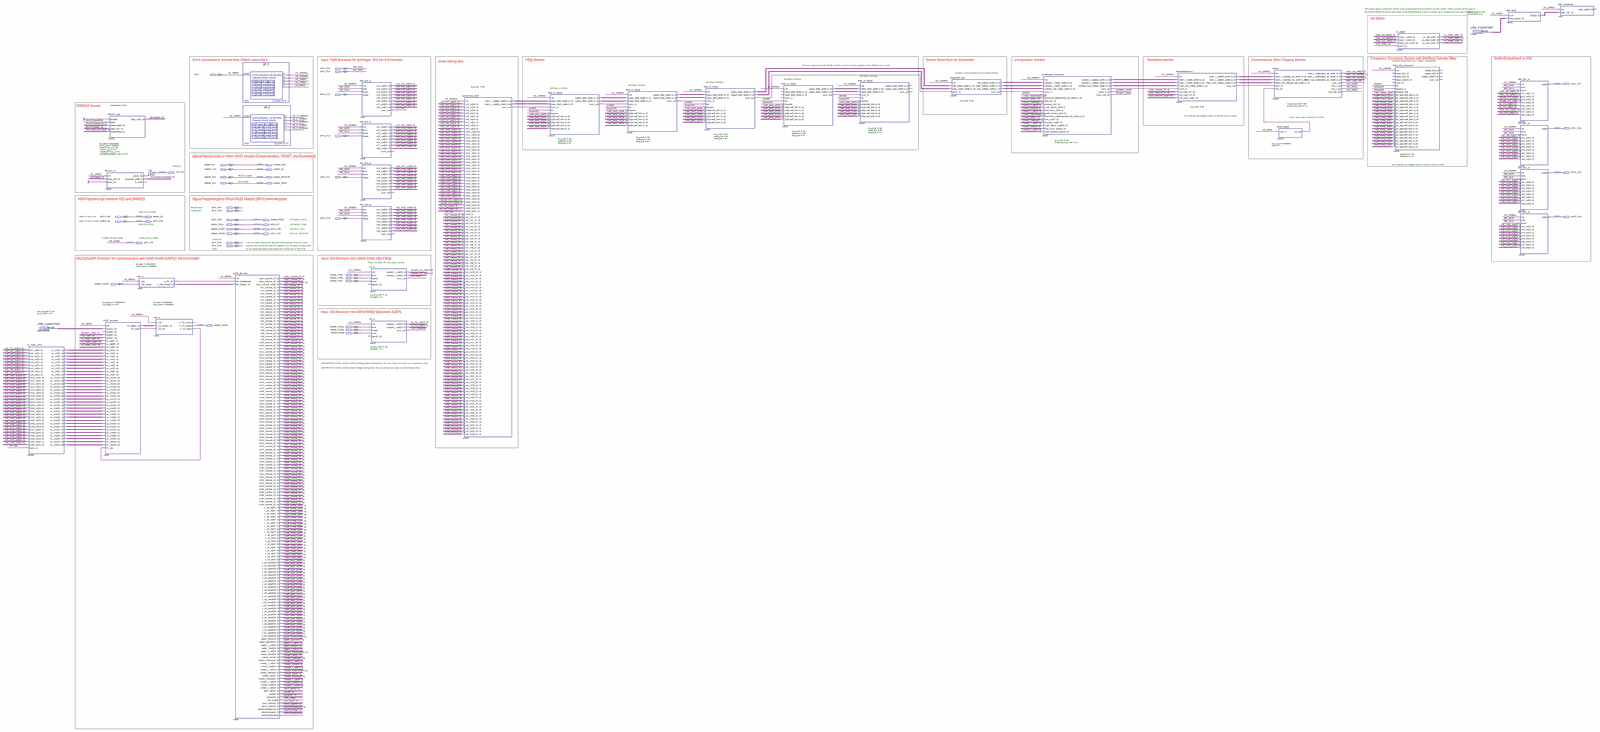
[diagram p0: schematic sheet, whole]
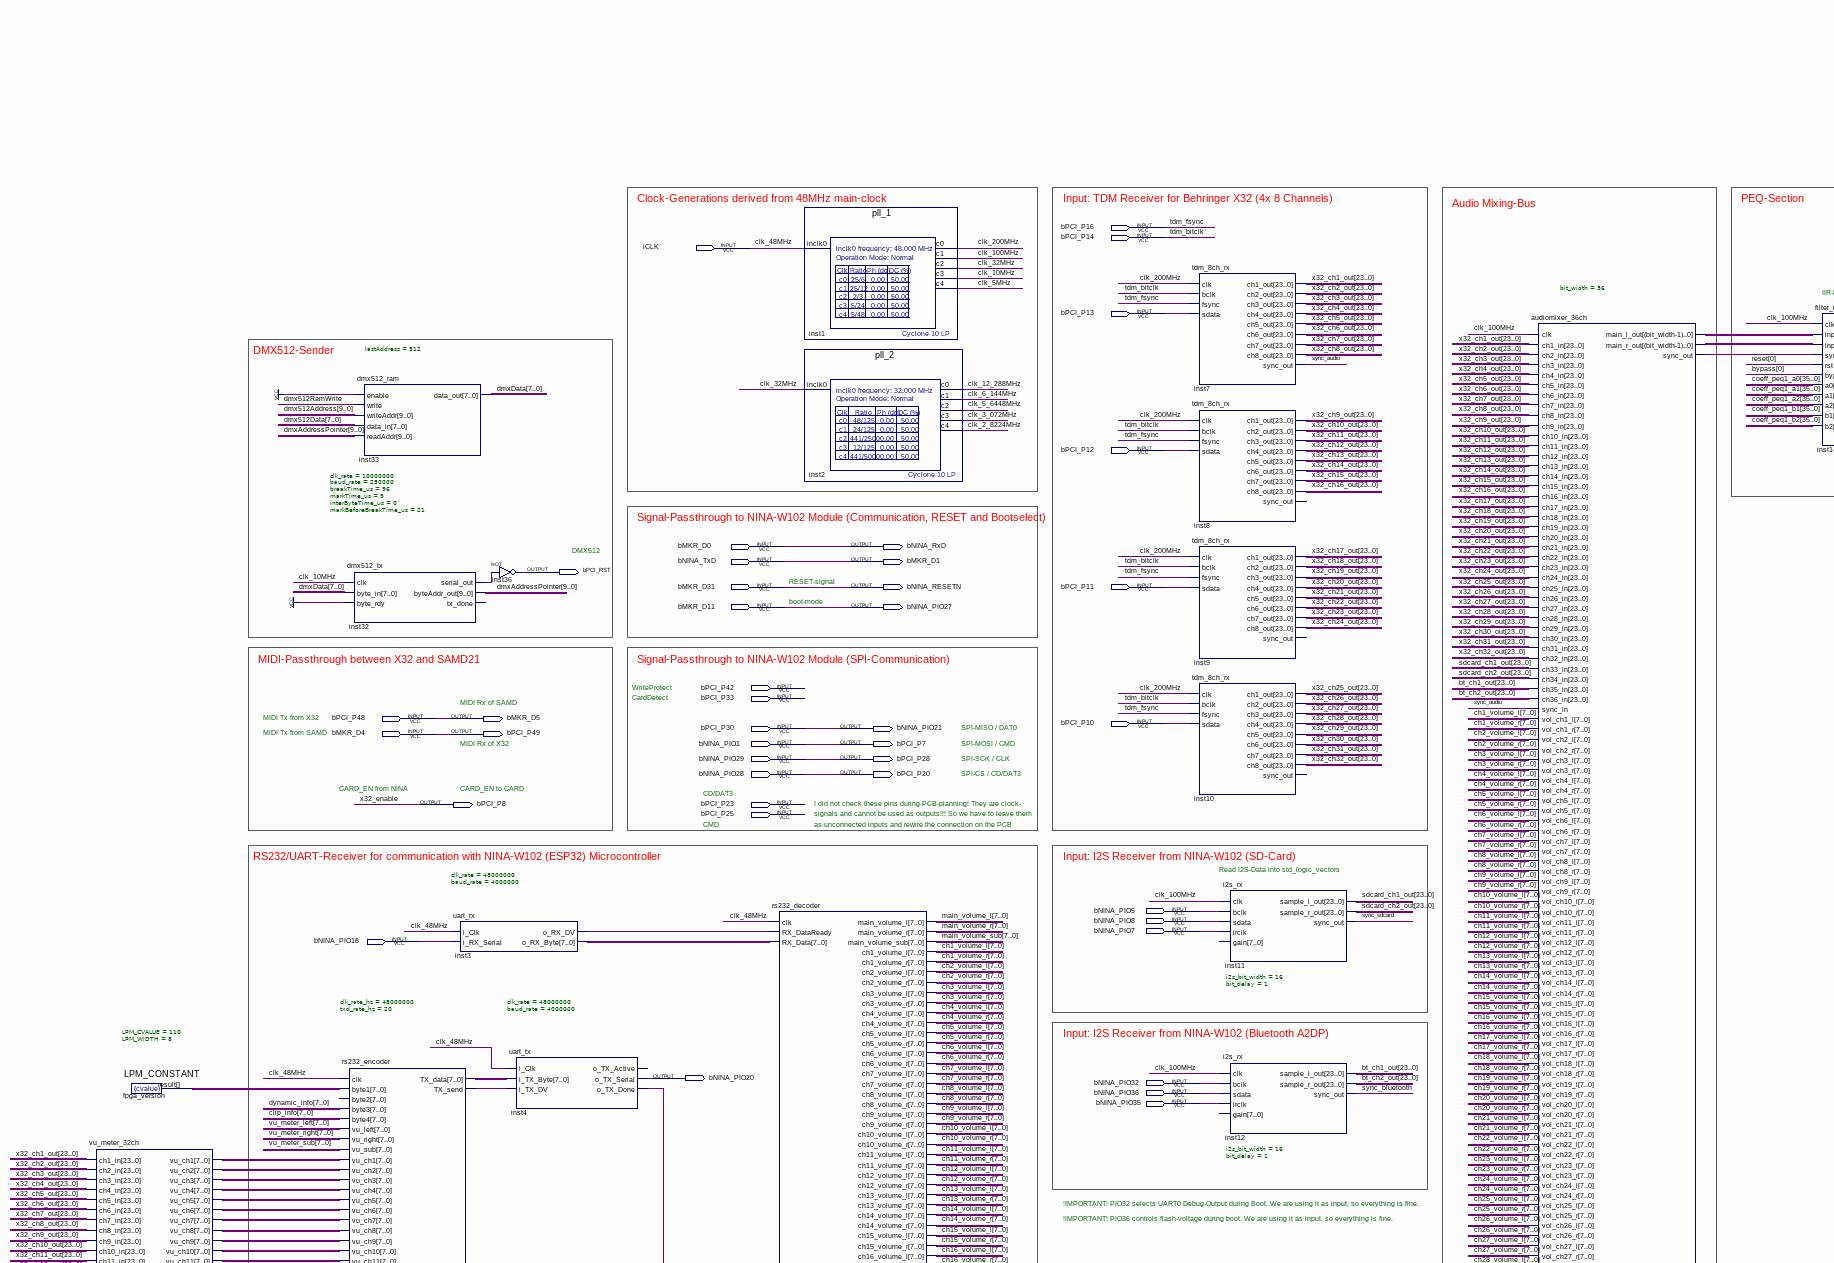
[diagram p1: schematic sheet, upper left part]
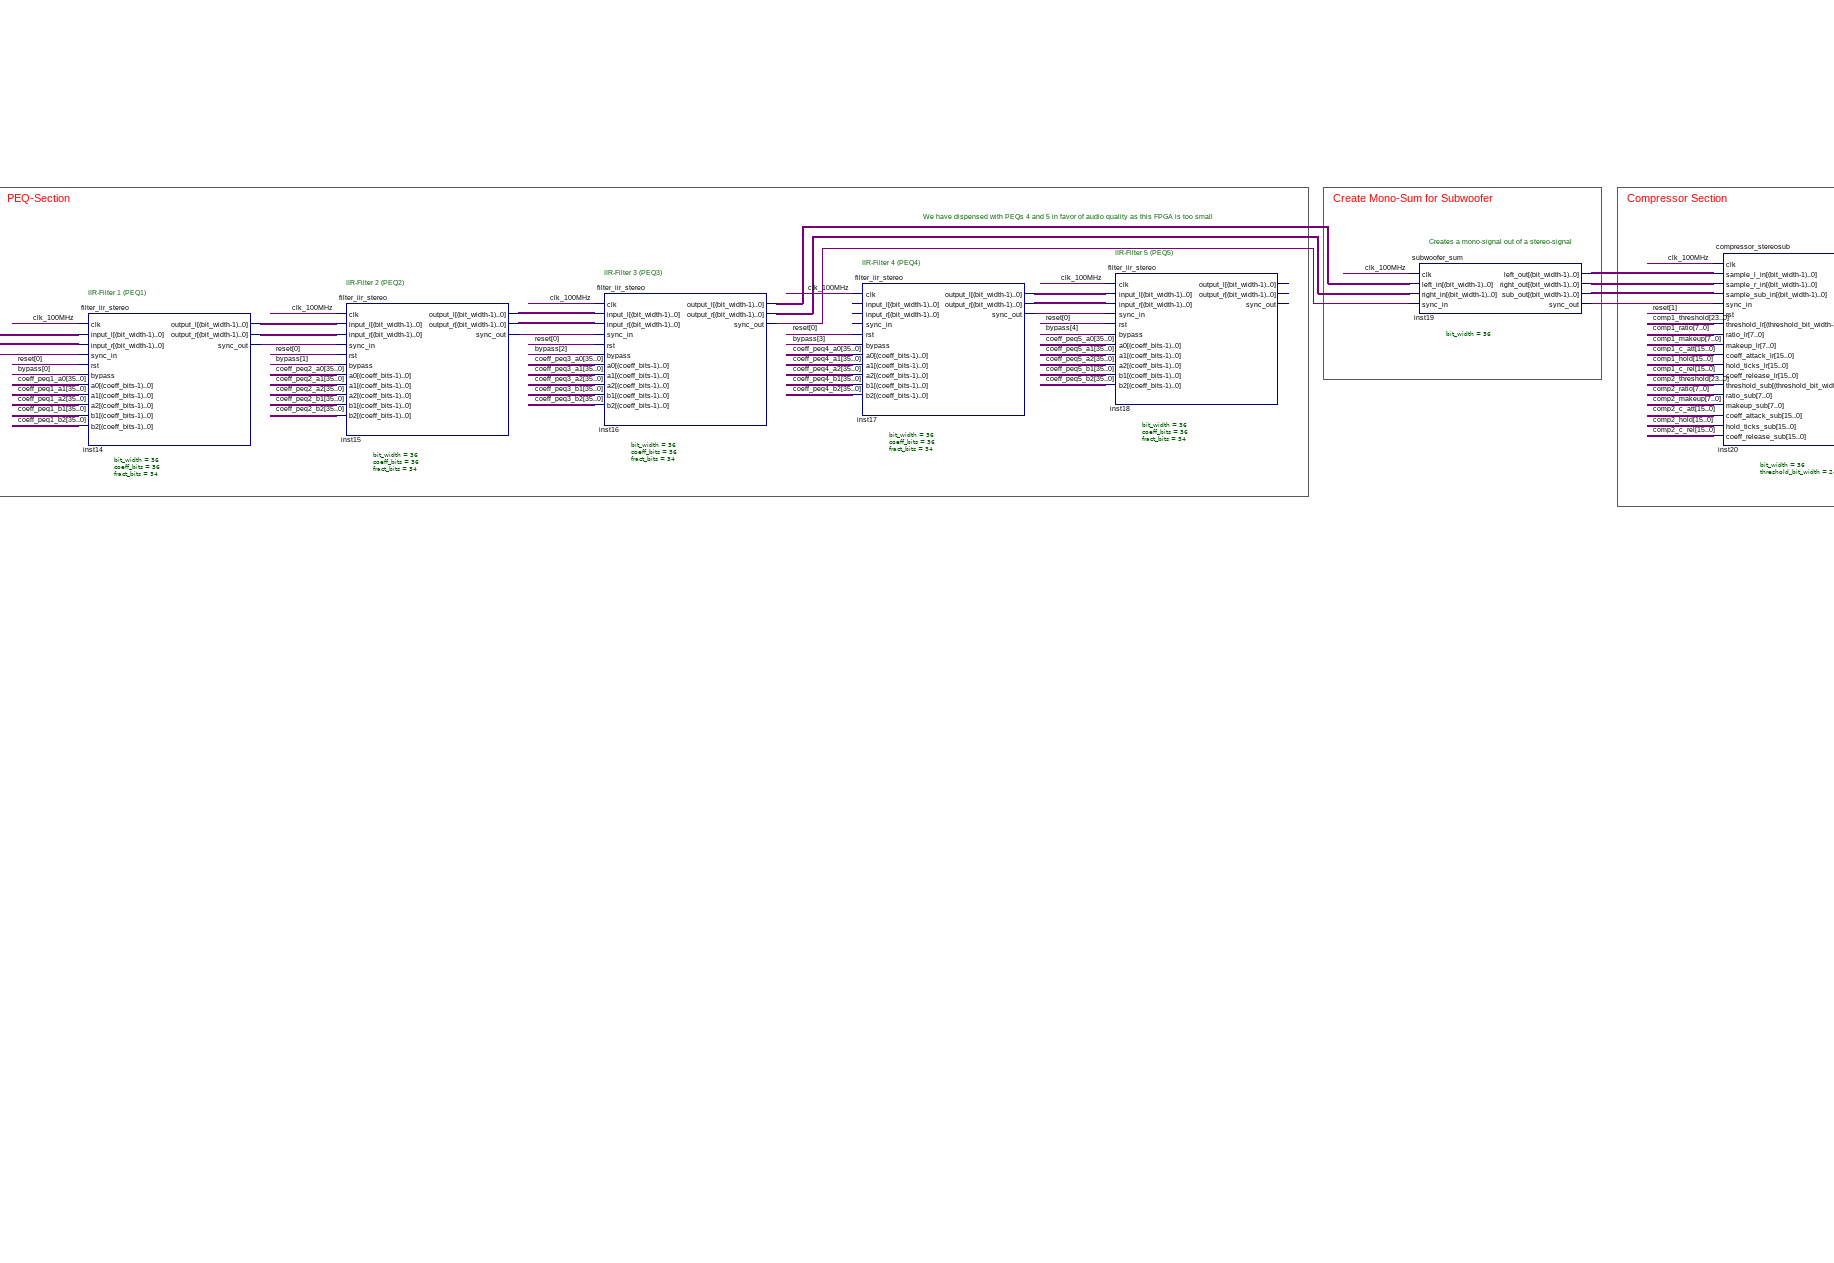
[diagram p2: schematic sheet, upper centre part]
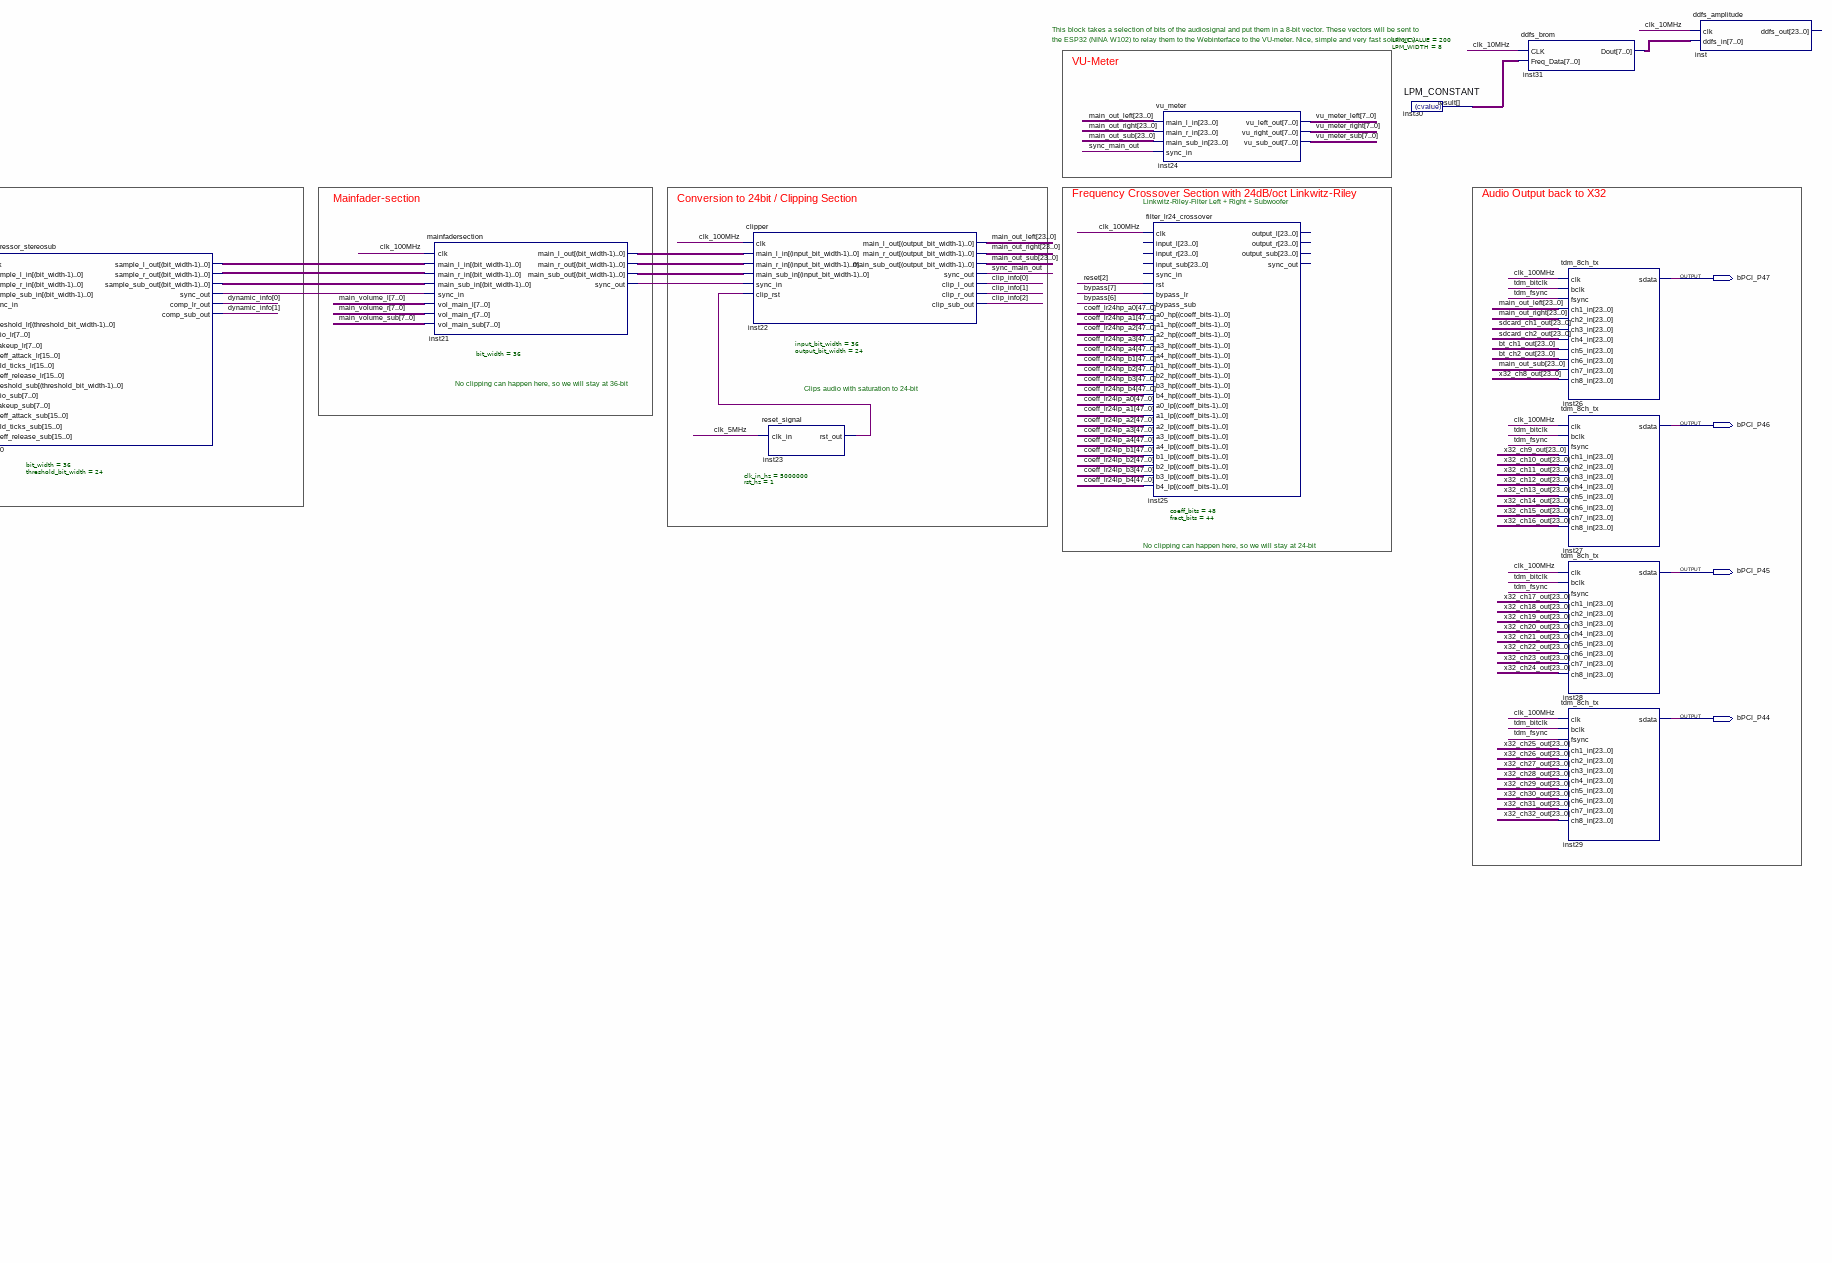
[diagram p3: schematic sheet, upper right part]
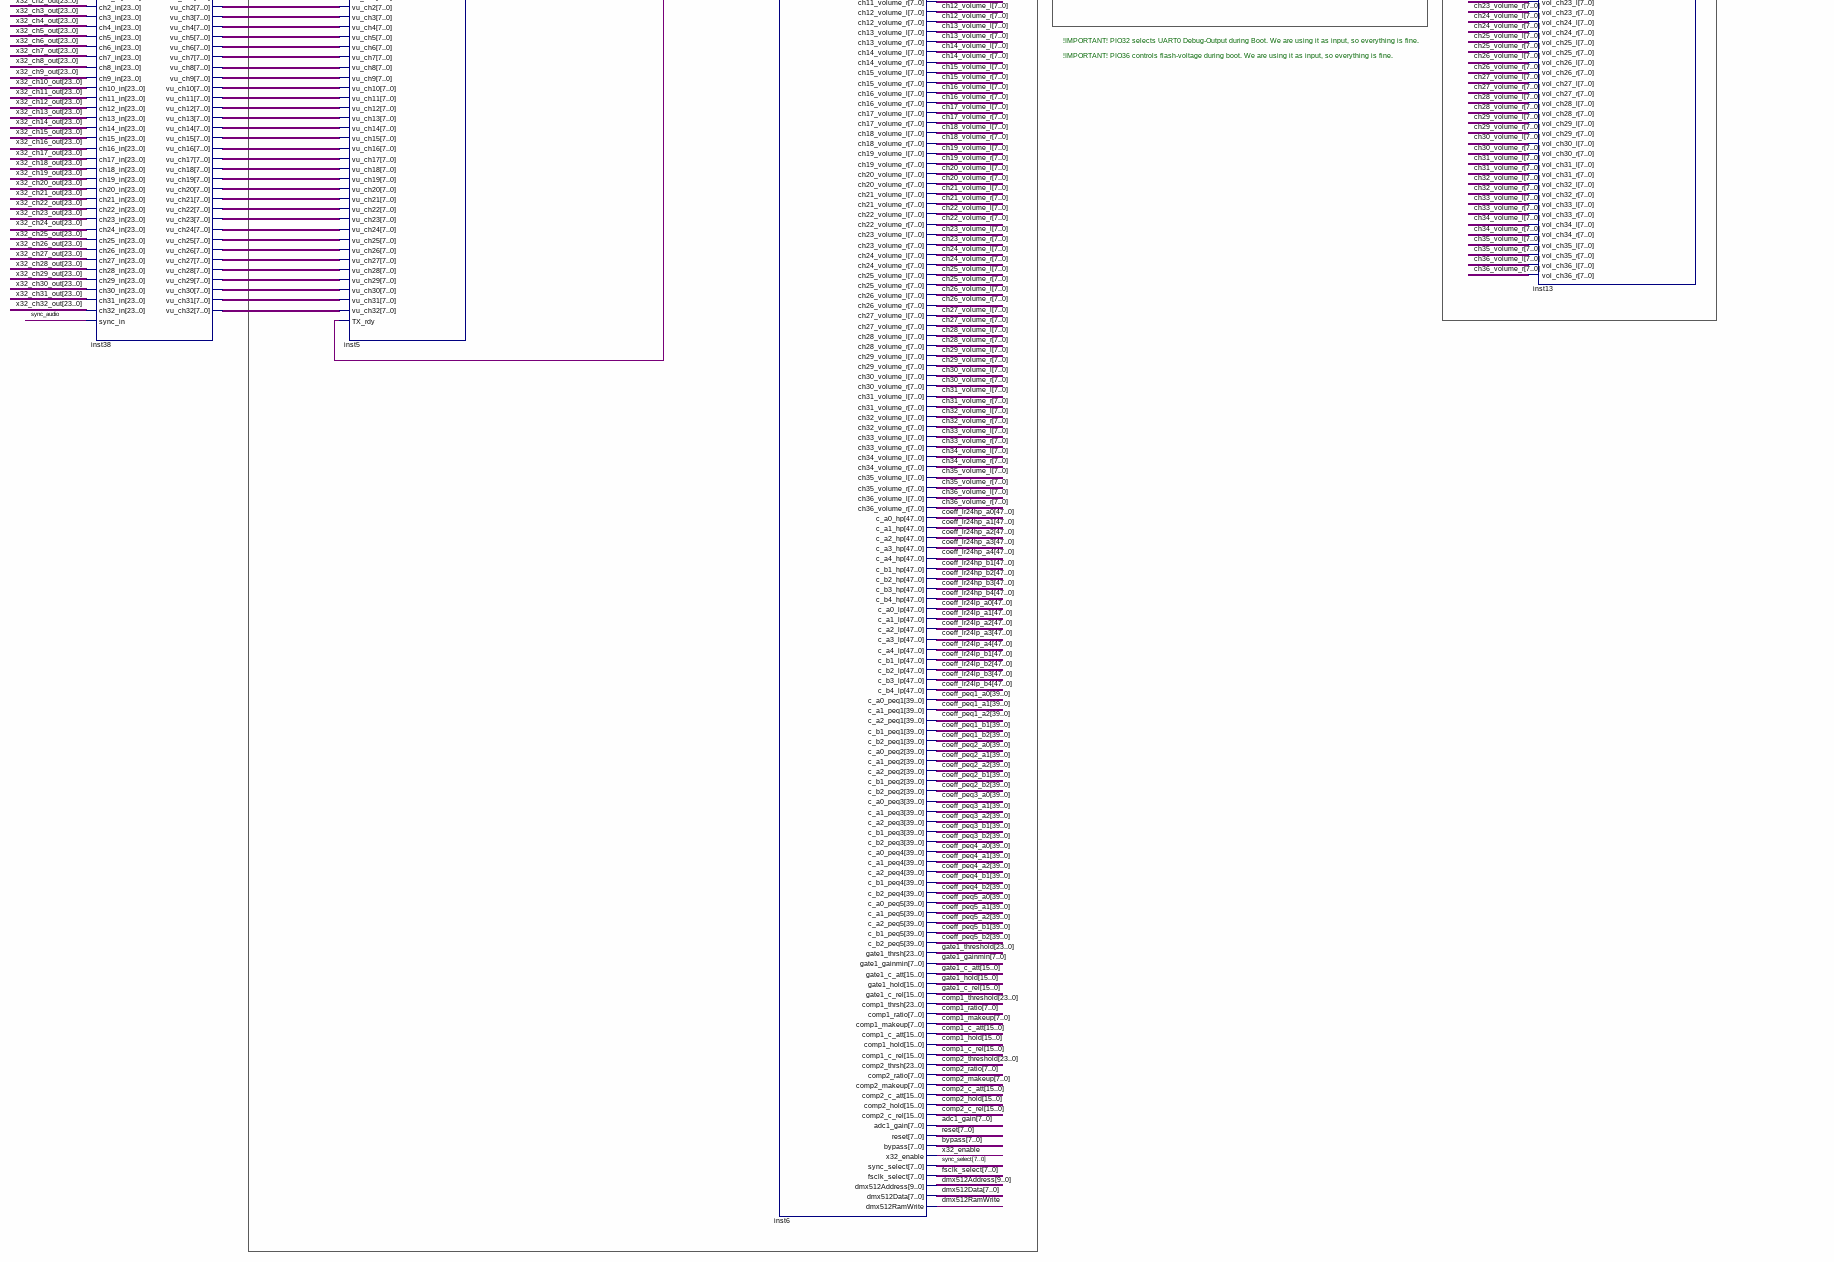
[diagram p4: schematic sheet, lower left part]
// Quartus schematic Audioplayer.bdf as structural Verilog: 37 symbols, 45 pins
module Audioplayer (
  input  bPCI_P16,
  input  bPCI_P14,
  input  iCLK,
  input  bPCI_P13,
  input  bPCI_P12,
  input  bMKR_D0,
  input  bNINA_TxD,
  input  bMKR_D31,
  input  bPCI_P11,
  input  bMKR_D11,
  input  bPCI_P42,
  input  bPCI_P33,
  input  bPCI_P48,
  input  bPCI_P10,
  input  bPCI_P30,
  input  bMKR_D4,
  input  bNINA_PIO1,
  input  bNINA_PIO29,
  input  bNINA_PIO28,
  input  bPCI_P23,
  input  bPCI_P25,
  input  bNINA_PIO5,
  input  bNINA_PIO8,
  input  bNINA_PIO7,
  input  bNINA_PIO18,
  input  bNINA_PIO32,
  input  bNINA_PIO36,
  input  bNINA_PIO35,
  output bPCI_P47,
  output bPCI_P46,
  output bNINA_RxD,
  output bMKR_D1,
  output bPCI_RST,
  output bPCI_P45,
  output bNINA_RESETN,
  output bNINA_PIO27,
  output bMKR_D5,
  output bPCI_P44,
  output bNINA_PIO21,
  output bPCI_P49,
  output bPCI_P7,
  output bPCI_P28,
  output bPCI_P20,
  output bPCI_P8,
  output bNINA_PIO20
);

  wire clk_2_8224MHz, clk_3_072MHz, clk_5_6448MHz, clk_5MHz, clk_6_144MHz, clk_10MHz, clk_12_288MHz,
       clk_32MHz, clk_100MHz, clk_200MHz, dmx512RamWrite, inst3_o_rx_dv, inst4_o_tx_done, inst5_tx_send,
       inst13_sync_out, inst14_sync_out, inst15_sync_out, inst16_sync_out, inst17_sync_out, inst19_sync_out,
       inst20_sync_out, inst21_sync_out, inst23_rst_out, inst32_serial_out, sync_audio, sync_bluetooth,
       sync_main_out, sync_sdcard;
  wire [7:0] adc1_gain, bypass, ch1_volume_l, ch1_volume_r, ch2_volume_l, ch2_volume_r, ch3_volume_l,
       ch3_volume_r, ch4_volume_l, ch4_volume_r, ch5_volume_l, ch5_volume_r, ch6_volume_l, ch6_volume_r,
       ch7_volume_l, ch7_volume_r, ch8_volume_l, ch8_volume_r, ch9_volume_l, ch9_volume_r, ch10_volume_l,
       ch10_volume_r, ch11_volume_l, ch11_volume_r, ch12_volume_l, ch12_volume_r, ch13_volume_l,
       ch13_volume_r, ch14_volume_l, ch14_volume_r, ch15_volume_l, ch15_volume_r, ch16_volume_l,
       ch16_volume_r, ch17_volume_l, ch17_volume_r, ch18_volume_l, ch18_volume_r, ch19_volume_l,
       ch19_volume_r, ch20_volume_l, ch20_volume_r, ch21_volume_l, ch21_volume_r, ch22_volume_l,
       ch22_volume_r, ch23_volume_l, ch23_volume_r, ch24_volume_l, ch24_volume_r, ch25_volume_l,
       ch25_volume_r, ch26_volume_l, ch26_volume_r, ch27_volume_l, ch27_volume_r, ch28_volume_l,
       ch28_volume_r, ch29_volume_l, ch29_volume_r, ch30_volume_l, ch30_volume_r, ch31_volume_l,
       ch31_volume_r, ch32_volume_l, ch32_volume_r, ch33_volume_l, ch33_volume_r, ch34_volume_l,
       ch34_volume_r, ch35_volume_l, ch35_volume_r, ch36_volume_l, ch36_volume_r, clip_info, comp1_makeup,
       comp1_ratio, comp2_makeup, comp2_ratio, dmx512Data, dmxData, dynamic_info, fpga_version_result,
       fsclk_select, gate1_gainmin, inst3_o_rx_byte, inst5_tx_data, inst30_result, inst31_dout,
       inst38_vu_ch1, inst38_vu_ch2, inst38_vu_ch3, inst38_vu_ch4, inst38_vu_ch5, inst38_vu_ch6,
       inst38_vu_ch7, inst38_vu_ch8, inst38_vu_ch9, inst38_vu_ch10, inst38_vu_ch11, inst38_vu_ch12,
       inst38_vu_ch13, inst38_vu_ch14, inst38_vu_ch15, inst38_vu_ch16, inst38_vu_ch17, inst38_vu_ch18,
       inst38_vu_ch19, inst38_vu_ch20, inst38_vu_ch21, inst38_vu_ch22, inst38_vu_ch23, inst38_vu_ch24,
       inst38_vu_ch25, inst38_vu_ch26, inst38_vu_ch27, inst38_vu_ch28, inst38_vu_ch29, inst38_vu_ch30,
       inst38_vu_ch31, inst38_vu_ch32, main_volume_l, main_volume_r, main_volume_sub, reset, sync_select,
       vu_meter_left, vu_meter_right, vu_meter_sub;
  wire [9:0] dmx512Address, dmxAddressPointer;
  wire [15:0] comp1_c_att, comp1_c_rel, comp1_hold, comp2_c_att, comp2_c_rel, comp2_hold, gate1_c_att,
       gate1_c_rel, gate1_hold;
  wire [23:0] bt_ch1_out, bt_ch2_out, comp1_threshold, comp2_threshold, gate1_threshold, main_out_left,
       main_out_right, main_out_sub, sdcard_ch1_out, sdcard_ch2_out, x32_ch1_out, x32_ch2_out, x32_ch3_out,
       x32_ch4_out, x32_ch5_out, x32_ch6_out, x32_ch7_out, x32_ch8_out, x32_ch9_out, x32_ch10_out,
       x32_ch11_out, x32_ch12_out, x32_ch13_out, x32_ch14_out, x32_ch15_out, x32_ch16_out, x32_ch17_out,
       x32_ch18_out, x32_ch19_out, x32_ch20_out, x32_ch21_out, x32_ch22_out, x32_ch23_out, x32_ch24_out,
       x32_ch25_out, x32_ch26_out, x32_ch27_out, x32_ch28_out, x32_ch29_out, x32_ch30_out, x32_ch31_out,
       x32_ch32_out;
  wire [35:0] inst13_main_l_out, inst13_main_r_out, inst14_output_l, inst14_output_r, inst15_output_l,
       inst15_output_r, inst16_output_l, inst16_output_r, inst17_output_l, inst17_output_r, inst19_left_out,
       inst19_right_out, inst19_sub_out, inst20_sample_l_out, inst20_sample_r_out, inst20_sample_sub_out,
       inst21_main_l_out, inst21_main_r_out, inst21_main_sub_out;
  wire [39:0] coeff_peq1_a0, coeff_peq1_a1, coeff_peq1_a2, coeff_peq1_b1, coeff_peq1_b2, coeff_peq2_a0,
       coeff_peq2_a1, coeff_peq2_a2, coeff_peq2_b1, coeff_peq2_b2, coeff_peq3_a0, coeff_peq3_a1,
       coeff_peq3_a2, coeff_peq3_b1, coeff_peq3_b2, coeff_peq4_a0, coeff_peq4_a1, coeff_peq4_a2,
       coeff_peq4_b1, coeff_peq4_b2, coeff_peq5_a0, coeff_peq5_a1, coeff_peq5_a2, coeff_peq5_b1,
       coeff_peq5_b2;
  wire [47:0] coeff_lr24hp_a0, coeff_lr24hp_a1, coeff_lr24hp_a2, coeff_lr24hp_a3, coeff_lr24hp_a4,
       coeff_lr24hp_b1, coeff_lr24hp_b2, coeff_lr24hp_b3, coeff_lr24hp_b4, coeff_lr24lp_a0, coeff_lr24lp_a1,
       coeff_lr24lp_a2, coeff_lr24lp_a3, coeff_lr24lp_a4, coeff_lr24lp_b1, coeff_lr24lp_b2, coeff_lr24lp_b3,
       coeff_lr24lp_b4;

  vu_meter_32ch inst38 (
    .ch1_in(x32_ch1_out), .ch2_in(x32_ch2_out), .ch3_in(x32_ch3_out), .ch4_in(x32_ch4_out),
    .ch5_in(x32_ch5_out), .ch6_in(x32_ch6_out), .ch7_in(x32_ch7_out), .ch8_in(x32_ch8_out),
    .ch9_in(x32_ch9_out), .ch10_in(x32_ch10_out), .ch11_in(x32_ch11_out), .ch12_in(x32_ch12_out),
    .ch13_in(x32_ch13_out), .ch14_in(x32_ch14_out), .ch15_in(x32_ch15_out), .ch16_in(x32_ch16_out),
    .ch17_in(x32_ch17_out), .ch18_in(x32_ch18_out), .ch19_in(x32_ch19_out), .ch20_in(x32_ch20_out),
    .ch21_in(x32_ch21_out), .ch22_in(x32_ch22_out), .ch23_in(x32_ch23_out), .ch24_in(x32_ch24_out),
    .ch25_in(x32_ch25_out), .ch26_in(x32_ch26_out), .ch27_in(x32_ch27_out), .ch28_in(x32_ch28_out),
    .ch29_in(x32_ch29_out), .ch30_in(x32_ch30_out), .ch31_in(x32_ch31_out), .ch32_in(x32_ch32_out),
    .sync_in(sync_audio), .vu_ch1(inst38_vu_ch1), .vu_ch2(inst38_vu_ch2), .vu_ch3(inst38_vu_ch3),
    .vu_ch4(inst38_vu_ch4), .vu_ch5(inst38_vu_ch5), .vu_ch6(inst38_vu_ch6), .vu_ch7(inst38_vu_ch7),
    .vu_ch8(inst38_vu_ch8), .vu_ch9(inst38_vu_ch9), .vu_ch10(inst38_vu_ch10), .vu_ch11(inst38_vu_ch11),
    .vu_ch12(inst38_vu_ch12), .vu_ch13(inst38_vu_ch13), .vu_ch14(inst38_vu_ch14), .vu_ch15(inst38_vu_ch15),
    .vu_ch16(inst38_vu_ch16), .vu_ch17(inst38_vu_ch17), .vu_ch18(inst38_vu_ch18), .vu_ch19(inst38_vu_ch19),
    .vu_ch20(inst38_vu_ch20), .vu_ch21(inst38_vu_ch21), .vu_ch22(inst38_vu_ch22), .vu_ch23(inst38_vu_ch23),
    .vu_ch24(inst38_vu_ch24), .vu_ch25(inst38_vu_ch25), .vu_ch26(inst38_vu_ch26), .vu_ch27(inst38_vu_ch27),
    .vu_ch28(inst38_vu_ch28), .vu_ch29(inst38_vu_ch29), .vu_ch30(inst38_vu_ch30), .vu_ch31(inst38_vu_ch31),
    .vu_ch32(inst38_vu_ch32));
  LPM_CONSTANT #(.LPM_CVALUE(110), .LPM_WIDTH(8)) fpga_version (.result(fpga_version_result));
  dmx512_ram #(.lastAddress(512)) inst33 (
    .enable(1'b1), .write(dmx512RamWrite), .writeAddr(dmx512Address), .data_in(dmx512Data),
    .readAddr(dmxAddressPointer), .data_out(dmxData));
  dmx512_tx #(.clk_rate(10000000), .baud_rate(250000), .breakTime_us(96), .markTime_us(9), .interByteTime_us(0), .markBeforeBreakTime_us(21)) inst32 (
    .clk(clk_10MHz), .byte_in(dmxData), .byte_rdy(1'b1), .serial_out(inst32_serial_out),
    .byteAddr_out(dmxAddressPointer));  // open: tx_done
  rs232_encoder #(.clk_rate_hz(48000000), .txd_rate_hz(20)) inst5 (
    .clk(iCLK), .byte1(fpga_version_result), .byte3(dynamic_info), .byte4(clip_info),
    .vu_left(vu_meter_left), .vu_right(vu_meter_right), .vu_sub(vu_meter_sub), .vu_ch1(inst38_vu_ch1),
    .vu_ch2(inst38_vu_ch2), .vu_ch3(inst38_vu_ch3), .vu_ch4(inst38_vu_ch4), .vu_ch5(inst38_vu_ch5),
    .vu_ch6(inst38_vu_ch6), .vu_ch7(inst38_vu_ch7), .vu_ch8(inst38_vu_ch8), .vu_ch9(inst38_vu_ch9),
    .vu_ch10(inst38_vu_ch10), .vu_ch11(inst38_vu_ch11), .vu_ch12(inst38_vu_ch12), .vu_ch13(inst38_vu_ch13),
    .vu_ch14(inst38_vu_ch14), .vu_ch15(inst38_vu_ch15), .vu_ch16(inst38_vu_ch16), .vu_ch17(inst38_vu_ch17),
    .vu_ch18(inst38_vu_ch18), .vu_ch19(inst38_vu_ch19), .vu_ch20(inst38_vu_ch20), .vu_ch21(inst38_vu_ch21),
    .vu_ch22(inst38_vu_ch22), .vu_ch23(inst38_vu_ch23), .vu_ch24(inst38_vu_ch24), .vu_ch25(inst38_vu_ch25),
    .vu_ch26(inst38_vu_ch26), .vu_ch27(inst38_vu_ch27), .vu_ch28(inst38_vu_ch28), .vu_ch29(inst38_vu_ch29),
    .vu_ch30(inst38_vu_ch30), .vu_ch31(inst38_vu_ch31), .vu_ch32(inst38_vu_ch32), .TX_rdy(inst4_o_tx_done),
    .TX_data(inst5_tx_data), .TX_send(inst5_tx_send));  // open: byte2
  uart_rx #(.clk_rate(48000000), .baud_rate(4000000)) inst3 (
    .i_Clk(iCLK), .i_RX_Serial(bNINA_PIO18), .o_RX_DV(inst3_o_rx_dv), .o_RX_Byte(inst3_o_rx_byte));
  not inst36 (bPCI_RST, inst32_serial_out);
  uart_tx #(.clk_rate(48000000), .baud_rate(4000000)) inst4 (
    .i_Clk(iCLK), .i_TX_Byte(inst5_tx_data), .i_TX_DV(inst5_tx_send), .o_TX_Serial(bNINA_PIO20),
    .o_TX_Done(inst4_o_tx_done));  // open: o_TX_Active
  rs232_decoder inst6 (
    .clk(iCLK), .RX_DataReady(inst3_o_rx_dv), .RX_Data(inst3_o_rx_byte), .main_volume_l(main_volume_l),
    .main_volume_r(main_volume_r), .main_volume_sub(main_volume_sub), .ch1_volume_l(ch1_volume_l),
    .ch1_volume_r(ch1_volume_r), .ch2_volume_l(ch2_volume_l), .ch2_volume_r(ch2_volume_r),
    .ch3_volume_l(ch3_volume_l), .ch3_volume_r(ch3_volume_r), .ch4_volume_l(ch4_volume_l),
    .ch4_volume_r(ch4_volume_r), .ch5_volume_l(ch5_volume_l), .ch5_volume_r(ch5_volume_r),
    .ch6_volume_l(ch6_volume_l), .ch6_volume_r(ch6_volume_r), .ch7_volume_l(ch7_volume_l),
    .ch7_volume_r(ch7_volume_r), .ch8_volume_l(ch8_volume_l), .ch8_volume_r(ch8_volume_r),
    .ch9_volume_l(ch9_volume_l), .ch9_volume_r(ch9_volume_r), .ch10_volume_l(ch10_volume_l),
    .ch10_volume_r(ch10_volume_r), .ch11_volume_l(ch11_volume_l), .ch11_volume_r(ch11_volume_r),
    .ch12_volume_l(ch12_volume_l), .ch12_volume_r(ch12_volume_r), .ch13_volume_l(ch13_volume_l),
    .ch13_volume_r(ch13_volume_r), .ch14_volume_l(ch14_volume_l), .ch14_volume_r(ch14_volume_r),
    .ch15_volume_l(ch15_volume_l), .ch15_volume_r(ch15_volume_r), .ch16_volume_l(ch16_volume_l),
    .ch16_volume_r(ch16_volume_r), .ch17_volume_l(ch17_volume_l), .ch17_volume_r(ch17_volume_r),
    .ch18_volume_l(ch18_volume_l), .ch18_volume_r(ch18_volume_r), .ch19_volume_l(ch19_volume_l),
    .ch19_volume_r(ch19_volume_r), .ch20_volume_l(ch20_volume_l), .ch20_volume_r(ch20_volume_r),
    .ch21_volume_l(ch21_volume_l), .ch21_volume_r(ch21_volume_r), .ch22_volume_l(ch22_volume_l),
    .ch22_volume_r(ch22_volume_r), .ch23_volume_l(ch23_volume_l), .ch23_volume_r(ch23_volume_r),
    .ch24_volume_l(ch24_volume_l), .ch24_volume_r(ch24_volume_r), .ch25_volume_l(ch25_volume_l),
    .ch25_volume_r(ch25_volume_r), .ch26_volume_l(ch26_volume_l), .ch26_volume_r(ch26_volume_r),
    .ch27_volume_l(ch27_volume_l), .ch27_volume_r(ch27_volume_r), .ch28_volume_l(ch28_volume_l),
    .ch28_volume_r(ch28_volume_r), .ch29_volume_l(ch29_volume_l), .ch29_volume_r(ch29_volume_r),
    .ch30_volume_l(ch30_volume_l), .ch30_volume_r(ch30_volume_r), .ch31_volume_l(ch31_volume_l),
    .ch31_volume_r(ch31_volume_r), .ch32_volume_l(ch32_volume_l), .ch32_volume_r(ch32_volume_r),
    .ch33_volume_l(ch33_volume_l), .ch33_volume_r(ch33_volume_r), .ch34_volume_l(ch34_volume_l),
    .ch34_volume_r(ch34_volume_r), .ch35_volume_l(ch35_volume_l), .ch35_volume_r(ch35_volume_r),
    .ch36_volume_l(ch36_volume_l), .ch36_volume_r(ch36_volume_r), .c_a0_hp(coeff_lr24hp_a0),
    .c_a1_hp(coeff_lr24hp_a1), .c_a2_hp(coeff_lr24hp_a2), .c_a3_hp(coeff_lr24hp_a3),
    .c_a4_hp(coeff_lr24hp_a4), .c_b1_hp(coeff_lr24hp_b1), .c_b2_hp(coeff_lr24hp_b2),
    .c_b3_hp(coeff_lr24hp_b3), .c_b4_hp(coeff_lr24hp_b4), .c_a0_lp(coeff_lr24lp_a0),
    .c_a1_lp(coeff_lr24lp_a1), .c_a2_lp(coeff_lr24lp_a2), .c_a3_lp(coeff_lr24lp_a3),
    .c_a4_lp(coeff_lr24lp_a4), .c_b1_lp(coeff_lr24lp_b1), .c_b2_lp(coeff_lr24lp_b2),
    .c_b3_lp(coeff_lr24lp_b3), .c_b4_lp(coeff_lr24lp_b4), .c_a0_peq1(coeff_peq1_a0),
    .c_a1_peq1(coeff_peq1_a1), .c_a2_peq1(coeff_peq1_a2), .c_b1_peq1(coeff_peq1_b1),
    .c_b2_peq1(coeff_peq1_b2), .c_a0_peq2(coeff_peq2_a0), .c_a1_peq2(coeff_peq2_a1),
    .c_a2_peq2(coeff_peq2_a2), .c_b1_peq2(coeff_peq2_b1), .c_b2_peq2(coeff_peq2_b2),
    .c_a0_peq3(coeff_peq3_a0), .c_a1_peq3(coeff_peq3_a1), .c_a2_peq3(coeff_peq3_a2),
    .c_b1_peq3(coeff_peq3_b1), .c_b2_peq3(coeff_peq3_b2), .c_a0_peq4(coeff_peq4_a0),
    .c_a1_peq4(coeff_peq4_a1), .c_a2_peq4(coeff_peq4_a2), .c_b1_peq4(coeff_peq4_b1),
    .c_b2_peq4(coeff_peq4_b2), .c_a0_peq5(coeff_peq5_a0), .c_a1_peq5(coeff_peq5_a1),
    .c_a2_peq5(coeff_peq5_a2), .c_b1_peq5(coeff_peq5_b1), .c_b2_peq5(coeff_peq5_b2),
    .gate1_thrsh(gate1_threshold), .gate1_gainmin(gate1_gainmin), .gate1_c_att(gate1_c_att),
    .gate1_hold(gate1_hold), .gate1_c_rel(gate1_c_rel), .comp1_thrsh(comp1_threshold),
    .comp1_ratio(comp1_ratio), .comp1_makeup(comp1_makeup), .comp1_c_att(comp1_c_att),
    .comp1_hold(comp1_hold), .comp1_c_rel(comp1_c_rel), .comp2_thrsh(comp2_threshold),
    .comp2_ratio(comp2_ratio), .comp2_makeup(comp2_makeup), .comp2_c_att(comp2_c_att),
    .comp2_hold(comp2_hold), .comp2_c_rel(comp2_c_rel), .adc1_gain(adc1_gain), .reset(reset),
    .bypass(bypass), .x32_enable(bPCI_P8), .sync_select(sync_select), .fsclk_select(fsclk_select),
    .dmx512Address(dmx512Address), .dmx512Data(dmx512Data), .dmx512RamWrite(dmx512RamWrite));
  pll_1 inst1 (.inclk0(iCLK), .c0(clk_200MHz), .c1(clk_100MHz), .c2(clk_32MHz), .c3(clk_10MHz), .c4(clk_5MHz));
  pll_2 inst2 (
    .inclk0(clk_32MHz), .c0(clk_12_288MHz), .c1(clk_6_144MHz), .c2(clk_5_6448MHz), .c3(clk_3_072MHz),
    .c4(clk_2_8224MHz));
  tdm_8ch_rx inst7 (
    .clk(clk_200MHz), .bclk(bPCI_P14), .fsync(bPCI_P16), .sdata(bPCI_P13), .ch1_out(x32_ch1_out),
    .ch2_out(x32_ch2_out), .ch3_out(x32_ch3_out), .ch4_out(x32_ch4_out), .ch5_out(x32_ch5_out),
    .ch6_out(x32_ch6_out), .ch7_out(x32_ch7_out), .ch8_out(x32_ch8_out), .sync_out(sync_audio));
  tdm_8ch_rx inst8 (
    .clk(clk_200MHz), .bclk(bPCI_P14), .fsync(bPCI_P16), .sdata(bPCI_P12), .ch1_out(x32_ch9_out),
    .ch2_out(x32_ch10_out), .ch3_out(x32_ch11_out), .ch4_out(x32_ch12_out), .ch5_out(x32_ch13_out),
    .ch6_out(x32_ch14_out), .ch7_out(x32_ch15_out), .ch8_out(x32_ch16_out));  // open: sync_out
  tdm_8ch_rx inst9 (
    .clk(clk_200MHz), .bclk(bPCI_P14), .fsync(bPCI_P16), .sdata(bPCI_P11), .ch1_out(x32_ch17_out),
    .ch2_out(x32_ch18_out), .ch3_out(x32_ch19_out), .ch4_out(x32_ch20_out), .ch5_out(x32_ch21_out),
    .ch6_out(x32_ch22_out), .ch7_out(x32_ch23_out), .ch8_out(x32_ch24_out));  // open: sync_out
  tdm_8ch_rx inst10 (
    .clk(clk_200MHz), .bclk(bPCI_P14), .fsync(bPCI_P16), .sdata(bPCI_P10), .ch1_out(x32_ch25_out),
    .ch2_out(x32_ch26_out), .ch3_out(x32_ch27_out), .ch4_out(x32_ch28_out), .ch5_out(x32_ch29_out),
    .ch6_out(x32_ch30_out), .ch7_out(x32_ch31_out), .ch8_out(x32_ch32_out));  // open: sync_out
  i2s_rx #(.i2s_bit_width(16), .bit_delay(1)) inst11 (
    .clk(clk_100MHz), .bclk(bNINA_PIO5), .sdata(bNINA_PIO8), .lrclk(bNINA_PIO7),
    .sample_l_out(sdcard_ch1_out), .sample_r_out(sdcard_ch2_out), .sync_out(sync_sdcard));  // open: gain
  i2s_rx #(.i2s_bit_width(16), .bit_delay(1)) inst12 (
    .clk(clk_100MHz), .bclk(bNINA_PIO32), .sdata(bNINA_PIO36), .lrclk(bNINA_PIO35),
    .sample_l_out(bt_ch1_out), .sample_r_out(bt_ch2_out), .sync_out(sync_bluetooth));  // open: gain
  audiomixer_36ch #(.bit_width(36)) inst13 (
    .clk(clk_100MHz), .ch1_in(x32_ch1_out), .ch2_in(x32_ch2_out), .ch3_in(x32_ch3_out), .ch4_in(x32_ch4_out),
    .ch5_in(x32_ch5_out), .ch6_in(x32_ch6_out), .ch7_in(x32_ch7_out), .ch8_in(x32_ch8_out),
    .ch9_in(x32_ch9_out), .ch10_in(x32_ch10_out), .ch11_in(x32_ch11_out), .ch12_in(x32_ch12_out),
    .ch13_in(x32_ch13_out), .ch14_in(x32_ch14_out), .ch15_in(x32_ch15_out), .ch16_in(x32_ch16_out),
    .ch17_in(x32_ch17_out), .ch18_in(x32_ch18_out), .ch19_in(x32_ch19_out), .ch20_in(x32_ch20_out),
    .ch21_in(x32_ch21_out), .ch22_in(x32_ch22_out), .ch23_in(x32_ch23_out), .ch24_in(x32_ch24_out),
    .ch25_in(x32_ch25_out), .ch26_in(x32_ch26_out), .ch27_in(x32_ch27_out), .ch28_in(x32_ch28_out),
    .ch29_in(x32_ch29_out), .ch30_in(x32_ch30_out), .ch31_in(x32_ch31_out), .ch32_in(x32_ch32_out),
    .ch33_in(sdcard_ch1_out), .ch34_in(sdcard_ch2_out), .ch35_in(bt_ch1_out), .ch36_in(bt_ch2_out),
    .sync_in(sync_audio), .vol_ch1_l(ch1_volume_l), .vol_ch1_r(ch1_volume_r), .vol_ch2_l(ch2_volume_l),
    .vol_ch2_r(ch2_volume_r), .vol_ch3_l(ch3_volume_l), .vol_ch3_r(ch3_volume_r), .vol_ch4_l(ch4_volume_l),
    .vol_ch4_r(ch4_volume_r), .vol_ch5_l(ch5_volume_l), .vol_ch5_r(ch5_volume_r), .vol_ch6_l(ch6_volume_l),
    .vol_ch6_r(ch6_volume_r), .vol_ch7_l(ch7_volume_l), .vol_ch7_r(ch7_volume_r), .vol_ch8_l(ch8_volume_l),
    .vol_ch8_r(ch8_volume_r), .vol_ch9_l(ch9_volume_l), .vol_ch9_r(ch9_volume_r), .vol_ch10_l(ch10_volume_l),
    .vol_ch10_r(ch10_volume_r), .vol_ch11_l(ch11_volume_l), .vol_ch11_r(ch11_volume_r),
    .vol_ch12_l(ch12_volume_l), .vol_ch12_r(ch12_volume_r), .vol_ch13_l(ch13_volume_l),
    .vol_ch13_r(ch13_volume_r), .vol_ch14_l(ch14_volume_l), .vol_ch14_r(ch14_volume_r),
    .vol_ch15_l(ch15_volume_l), .vol_ch15_r(ch15_volume_r), .vol_ch16_l(ch16_volume_l),
    .vol_ch16_r(ch16_volume_r), .vol_ch17_l(ch17_volume_l), .vol_ch17_r(ch17_volume_r),
    .vol_ch18_l(ch18_volume_l), .vol_ch18_r(ch18_volume_r), .vol_ch19_l(ch19_volume_l),
    .vol_ch19_r(ch19_volume_r), .vol_ch20_l(ch20_volume_l), .vol_ch20_r(ch20_volume_r),
    .vol_ch21_l(ch21_volume_l), .vol_ch21_r(ch21_volume_r), .vol_ch22_l(ch22_volume_l),
    .vol_ch22_r(ch22_volume_r), .vol_ch23_l(ch23_volume_l), .vol_ch23_r(ch23_volume_r),
    .vol_ch24_l(ch24_volume_l), .vol_ch24_r(ch24_volume_r), .vol_ch25_l(ch25_volume_l),
    .vol_ch25_r(ch25_volume_r), .vol_ch26_l(ch26_volume_l), .vol_ch26_r(ch26_volume_r),
    .vol_ch27_l(ch27_volume_l), .vol_ch27_r(ch27_volume_r), .vol_ch28_l(ch28_volume_l),
    .vol_ch28_r(ch28_volume_r), .vol_ch29_l(ch29_volume_l), .vol_ch29_r(ch29_volume_r),
    .vol_ch30_l(ch30_volume_l), .vol_ch30_r(ch30_volume_r), .vol_ch31_l(ch31_volume_l),
    .vol_ch31_r(ch31_volume_r), .vol_ch32_l(ch32_volume_l), .vol_ch32_r(ch32_volume_r),
    .vol_ch33_l(ch33_volume_l), .vol_ch33_r(ch33_volume_r), .vol_ch34_l(ch34_volume_l),
    .vol_ch34_r(ch34_volume_r), .vol_ch35_l(ch35_volume_l), .vol_ch35_r(ch35_volume_r),
    .vol_ch36_l(ch36_volume_l), .vol_ch36_r(ch36_volume_r), .main_l_out(inst13_main_l_out),
    .main_r_out(inst13_main_r_out), .sync_out(inst13_sync_out));
  filter_iir_stereo #(.bit_width(36), .coeff_bits(36), .fract_bits(34)) inst14 (
    .clk(clk_100MHz), .input_l(inst13_main_l_out), .input_r(inst13_main_r_out), .sync_in(inst13_sync_out),
    .rst(reset[0]), .bypass(bypass[0]), .a0(coeff_peq1_a0[35:0]), .a1(coeff_peq1_a1[35:0]),
    .a2(coeff_peq1_a2[35:0]), .b1(coeff_peq1_b1[35:0]), .b2(coeff_peq1_b2[35:0]), .output_l(inst14_output_l),
    .output_r(inst14_output_r), .sync_out(inst14_sync_out));
  filter_iir_stereo #(.bit_width(36), .coeff_bits(36), .fract_bits(34)) inst15 (
    .clk(clk_100MHz), .input_l(inst14_output_l), .input_r(inst14_output_r), .sync_in(inst14_sync_out),
    .rst(reset[0]), .bypass(bypass[1]), .a0(coeff_peq2_a0[35:0]), .a1(coeff_peq2_a1[35:0]),
    .a2(coeff_peq2_a2[35:0]), .b1(coeff_peq2_b1[35:0]), .b2(coeff_peq2_b2[35:0]), .output_l(inst15_output_l),
    .output_r(inst15_output_r), .sync_out(inst15_sync_out));
  filter_iir_stereo #(.bit_width(36), .coeff_bits(36), .fract_bits(34)) inst16 (
    .clk(clk_100MHz), .input_l(inst15_output_l), .input_r(inst15_output_r), .sync_in(inst15_sync_out),
    .rst(reset[0]), .bypass(bypass[2]), .a0(coeff_peq3_a0[35:0]), .a1(coeff_peq3_a1[35:0]),
    .a2(coeff_peq3_a2[35:0]), .b1(coeff_peq3_b1[35:0]), .b2(coeff_peq3_b2[35:0]), .output_l(inst16_output_l),
    .output_r(inst16_output_r), .sync_out(inst16_sync_out));
  filter_iir_stereo #(.bit_width(36), .coeff_bits(36), .fract_bits(34)) inst17 (
    .clk(clk_100MHz), .rst(reset[0]), .bypass(bypass[3]), .a0(coeff_peq4_a0[35:0]), .a1(coeff_peq4_a1[35:0]),
    .a2(coeff_peq4_a2[35:0]), .b1(coeff_peq4_b1[35:0]), .b2(coeff_peq4_b2[35:0]), .output_l(inst17_output_l),
    .output_r(inst17_output_r), .sync_out(inst17_sync_out));  // open: input_l, input_r, sync_in
  filter_iir_stereo #(.bit_width(36), .coeff_bits(36), .fract_bits(34)) inst18 (
    .clk(clk_100MHz), .input_l(inst17_output_l), .input_r(inst17_output_r), .sync_in(inst17_sync_out),
    .rst(reset[0]), .bypass(bypass[4]), .a0(coeff_peq5_a0[35:0]), .a1(coeff_peq5_a1[35:0]),
    .a2(coeff_peq5_a2[35:0]), .b1(coeff_peq5_b1[35:0]), .b2(coeff_peq5_b2[35:0]));  // open: output_l, output_r, sync_out
  subwoofer_sum #(.bit_width(36)) inst19 (
    .clk(clk_100MHz), .left_in(inst16_output_l), .right_in(inst16_output_r), .sync_in(inst16_sync_out),
    .left_out(inst19_left_out), .right_out(inst19_right_out), .sub_out(inst19_sub_out),
    .sync_out(inst19_sync_out));
  compressor_stereosub #(.bit_width(36), .threshold_bit_width(24)) inst20 (
    .clk(clk_100MHz), .sample_l_in(inst19_left_out), .sample_r_in(inst19_right_out),
    .sample_sub_in(inst19_sub_out), .sync_in(inst19_sync_out), .rst(reset[1]),
    .threshold_lr(comp1_threshold), .ratio_lr(comp1_ratio), .makeup_lr(comp1_makeup),
    .coeff_attack_lr(comp1_c_att), .hold_ticks_lr(comp1_hold), .coeff_release_lr(comp1_c_rel),
    .threshold_sub(comp2_threshold), .ratio_sub(comp2_ratio), .makeup_sub(comp2_makeup),
    .coeff_attack_sub(comp2_c_att), .hold_ticks_sub(comp2_hold), .coeff_release_sub(comp2_c_rel),
    .sample_l_out(inst20_sample_l_out), .sample_r_out(inst20_sample_r_out),
    .sample_sub_out(inst20_sample_sub_out), .sync_out(inst20_sync_out), .comp_lr_out(dynamic_info[0]),
    .comp_sub_out(dynamic_info[1]));
  mainfadersection #(.bit_width(36)) inst21 (
    .clk(clk_100MHz), .main_l_in(inst20_sample_l_out), .main_r_in(inst20_sample_r_out),
    .main_sub_in(inst20_sample_sub_out), .sync_in(inst20_sync_out), .vol_main_l(main_volume_l),
    .vol_main_r(main_volume_r), .vol_main_sub(main_volume_sub), .main_l_out(inst21_main_l_out),
    .main_r_out(inst21_main_r_out), .main_sub_out(inst21_main_sub_out), .sync_out(inst21_sync_out));
  clipper #(.input_bit_width(36), .output_bit_width(24)) inst22 (
    .clk(clk_100MHz), .main_l_in(inst21_main_l_out), .main_r_in(inst21_main_r_out),
    .main_sub_in(inst21_main_sub_out), .sync_in(inst21_sync_out), .clip_rst(inst23_rst_out),
    .main_l_out(main_out_left), .main_r_out(main_out_right), .main_sub_out(main_out_sub),
    .sync_out(sync_main_out), .clip_l_out(clip_info[0]), .clip_r_out(clip_info[1]),
    .clip_sub_out(clip_info[2]));
  reset_signal #(.clk_in_hz(5000000), .rst_hz(1)) inst23 (.clk_in(clk_5MHz), .rst_out(inst23_rst_out));
  vu_meter inst24 (
    .main_l_in(main_out_left), .main_r_in(main_out_right), .main_sub_in(main_out_sub),
    .sync_in(sync_main_out), .vu_left_out(vu_meter_left), .vu_right_out(vu_meter_right),
    .vu_sub_out(vu_meter_sub));
  filter_lr24_crossover #(.coeff_bits(48), .fract_bits(44)) inst25 (
    .clk(clk_100MHz), .rst(reset[2]), .bypass_lr(bypass[7]), .bypass_sub(bypass[6]), .a0_hp(coeff_lr24hp_a0),
    .a1_hp(coeff_lr24hp_a1), .a2_hp(coeff_lr24hp_a2), .a3_hp(coeff_lr24hp_a3), .a4_hp(coeff_lr24hp_a4),
    .b1_hp(coeff_lr24hp_b1), .b2_hp(coeff_lr24hp_b2), .b3_hp(coeff_lr24hp_b3), .b4_hp(coeff_lr24hp_b4),
    .a0_lp(coeff_lr24lp_a0), .a1_lp(coeff_lr24lp_a1), .a2_lp(coeff_lr24lp_a2), .a3_lp(coeff_lr24lp_a3),
    .a4_lp(coeff_lr24lp_a4), .b1_lp(coeff_lr24lp_b1), .b2_lp(coeff_lr24lp_b2), .b3_lp(coeff_lr24lp_b3),
    .b4_lp(coeff_lr24lp_b4));  // open: input_l, input_r, input_sub, sync_in, output_l, output_r, output_sub, sync_out
  LPM_CONSTANT #(.LPM_CVALUE(200), .LPM_WIDTH(8)) inst30 (.result(inst30_result));
  ddfs_brom inst31 (.CLK(clk_10MHz), .Freq_Data(inst30_result), .Dout(inst31_dout));
  tdm_8ch_tx inst26 (
    .clk(clk_100MHz), .bclk(bPCI_P14), .fsync(bPCI_P16), .ch1_in(main_out_left), .ch2_in(main_out_right),
    .ch3_in(sdcard_ch1_out), .ch4_in(sdcard_ch2_out), .ch5_in(bt_ch1_out), .ch6_in(bt_ch2_out),
    .ch7_in(main_out_sub), .ch8_in(x32_ch8_out), .sdata(bPCI_P47));
  tdm_8ch_tx inst27 (
    .clk(clk_100MHz), .bclk(bPCI_P14), .fsync(bPCI_P16), .ch1_in(x32_ch9_out), .ch2_in(x32_ch10_out),
    .ch3_in(x32_ch11_out), .ch4_in(x32_ch12_out), .ch5_in(x32_ch13_out), .ch6_in(x32_ch14_out),
    .ch7_in(x32_ch15_out), .ch8_in(x32_ch16_out), .sdata(bPCI_P46));
  tdm_8ch_tx inst28 (
    .clk(clk_100MHz), .bclk(bPCI_P14), .fsync(bPCI_P16), .ch1_in(x32_ch17_out), .ch2_in(x32_ch18_out),
    .ch3_in(x32_ch19_out), .ch4_in(x32_ch20_out), .ch5_in(x32_ch21_out), .ch6_in(x32_ch22_out),
    .ch7_in(x32_ch23_out), .ch8_in(x32_ch24_out), .sdata(bPCI_P45));
  tdm_8ch_tx inst29 (
    .clk(clk_100MHz), .bclk(bPCI_P14), .fsync(bPCI_P16), .ch1_in(x32_ch25_out), .ch2_in(x32_ch26_out),
    .ch3_in(x32_ch27_out), .ch4_in(x32_ch28_out), .ch5_in(x32_ch29_out), .ch6_in(x32_ch30_out),
    .ch7_in(x32_ch31_out), .ch8_in(x32_ch32_out), .sdata(bPCI_P44));
  ddfs_amplitude inst (.clk(clk_10MHz), .ddfs_in(inst31_dout));  // open: ddfs_out

  assign bMKR_D1 = bNINA_TxD;
  assign bMKR_D5 = bPCI_P48;
  assign bNINA_PIO21 = bPCI_P30;
  assign bNINA_PIO27 = bMKR_D11;
  assign bNINA_RESETN = bMKR_D31;
  assign bNINA_RxD = bMKR_D0;
  assign bPCI_P7 = bNINA_PIO1;
  assign bPCI_P20 = bNINA_PIO28;
  assign bPCI_P28 = bNINA_PIO29;
  assign bPCI_P49 = bMKR_D4;

  // Other names for the same wires on the sheet: clk_48MHz = iCLK; tdm_bitclk = bPCI_P14; tdm_fsync = bPCI_P16;
  //   x32_enable = bPCI_P8

  // Notes on the sheet:
  //   This block takes a selection of bits of the audiosignal and put them in a 8-bit vector. These vectors will be sent to
  //   the ESP32 (NINA W102) to relay them to the Webinterface to the VU-meter. Nice, simple and very fast solution :)
  //   VU-Meter
  //   Frequency Crossover Section with 24dB/oct Linkwitz-Riley
  //   Audio Output back to X32
  //   Clock-Generations derived from 48MHz main-clock
  //   Input: TDM Receiver for Behringer X32 (4x 8 Channels)
  //   PEQ-Section
  //   Create Mono-Sum for Subwoofer
  //   Compressor Section
  //   Mainfader-section
  //   Conversion to 24bit / Clipping Section
  //   Audio Mixing-Bus
  //   Linkwitz-Riley-Filter Left + Right + Subwoofer
  //   We have dispensed with PEQs 4 and 5 in favor of audio quality as this FPGA is too small
  //   Creates a mono-signal out of a stereo-signal
  //   IIR-Filter 5 (PEQ5)
  //   IIR-Filter 4 (PEQ4)
  //   IIR-Filter 3 (PEQ3)
  //   IIR-Filter 2 (PEQ2)
  //   IIR-Filter 1 (PEQ1)
  //   DMX512-Sender
  //   No clipping can happen here, so we will stay at 36-bit
  //   Clips audio with saturation to 24-bit
  //   Signal-Passthrough to NINA-W102 Module (Communication, RESET and Bootselect)
  //   No clipping can happen here, so we will stay at 24-bit
  //   DMX512
  //   RESET-signal
  //   boot-mode
  //   MIDI-Passthrough between X32 and SAMD21
  //   Signal-Passthrough to NINA-W102 Module (SPI-Communication)
  //   WriteProtect
  //   CardDetect
  //   MIDI Rx of SAMD
  //   MIDI Tx from X32
  //   SPI-MISO / DAT0
  //   MIDI Tx from SAMD
  //   MIDI Rx of X32
  //   SPI-MOSI / CMD
  //   SPI-SCK / CLK
  //   SPI-CS / CD/DAT3
  //   CARD_EN from NINA
  //   CARD_EN to CARD
  //   CD/DAT3
  //   I did not check these pins during PCB-planning! They are clock-
  //   signals and cannot be used as outputs!!! So we have to leave them
  //   CMD
  //   as unconnected inputs and rewire the connection on the PCB
  //   RS232/UART-Receiver for communication with NINA-W102 (ESP32) Microcontroller
  //   Input: I2S Receiver from NINA-W102 (SD-Card)
  //   Read I2S-Data into std_logic_vectors
  //   Input: I2S Receiver from NINA-W102 (Bluetooth A2DP)
  //   !IMPORTANT! PIO32 selects UART0 Debug-Output during Boot. We are using it as input, so everything is fine.
  //   !IMPORTANT! PIO36 controls flash-voltage during boot. We are using it as input, so everything is fine.
endmodule
